# Altium schematic sheet FPGA_52_CAN_Receiver.SchDoc
size A3; Address1: L3, 12a Rodborough Rd; Address2: Frenchs Forest; Address3: NSW; Address4: Australia 2086; Organization: Altium Limited
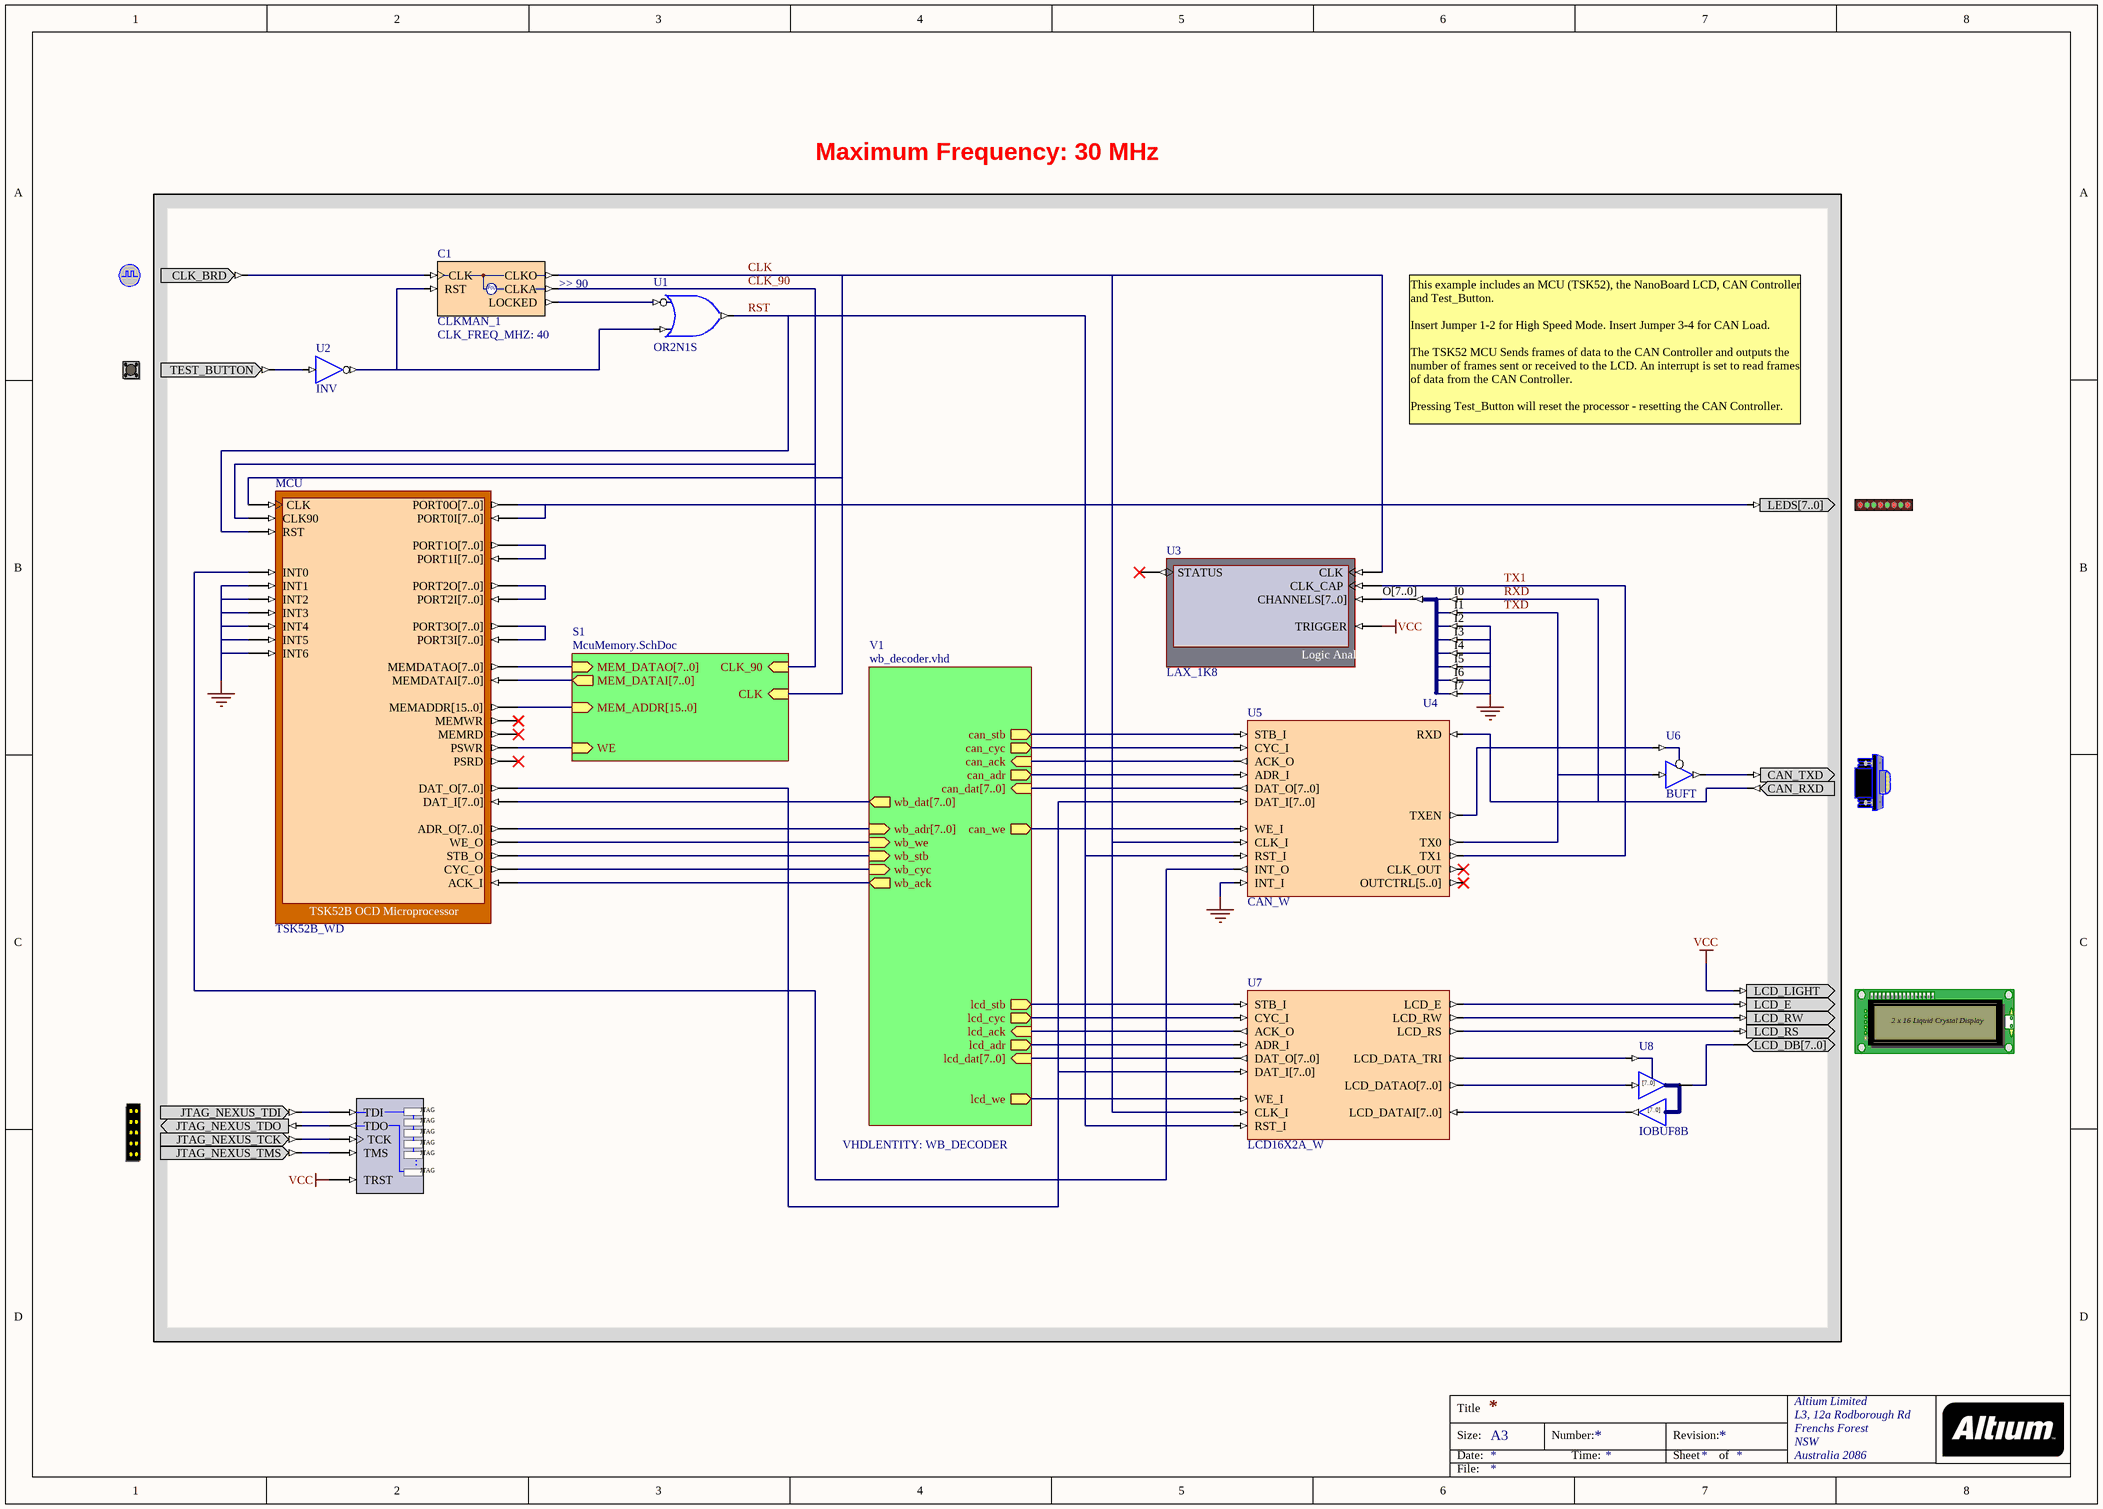
[diagram p0: FPGA_52_CAN_Receiver.SchDoc]

## Parts
(Parts that share a designator on the sheet are numbered #1, #2 ... from top to bottom, then left to right.)
?#1  CLOCK_BOARD  (value not drawn)
?#2  TEST_BUTTON  (value not drawn)
?#3  LED  (value not drawn)
?#4  CANCNTR  (value not drawn)
?#5  LCD  (value not drawn)
?#6  NEXUS_JTAG_CONNECTOR  (value not drawn)
C1  CLKMAN_1  CLK_FREQ_MHZ: 40  ClkA_Operation: >> 90
MCU  TSK52B_WD
NEXUS_JTAG_PORT  NEXUS_JTAG_PORT  (value not drawn)
U1  OR2N1S
U2  INV
U3  LAX_1K8
U4  J8S_8B  (value not drawn)
U5  CAN_W
U6  BUFT
U7  LCD16X2A_W
U8  IOBUF8B

## Sub-sheets
S1 = McuMemory.SchDoc: MEM_ADDR[15..0] (in), MEM_DATAI[7..0] (out), MEM_DATAO[7..0] (in), WE (in), CLK (in), CLK_90 (in)
V1 = wb_decoder.vhd: can_ack (in), can_adr (out), can_cyc (out), can_dat[7..0] (in), can_stb (out), can_we (out), lcd_ack (in), lcd_adr (out), lcd_cyc (out), lcd_dat[7..0] (in), lcd_stb (out), lcd_we (out), wb_ack (out), wb_adr[7..0] (in), wb_cyc (in), wb_dat[7..0] (out), wb_stb (in), wb_we (in)  | VHDLENTITY: WB_DECODER

## Nets
GND: MCU.INT1 MCU.INT2 MCU.INT3 MCU.INT4 MCU.INT5 MCU.INT6 U4.I2 U4.I3 U4.I4 U4.I5 U4.I6 U4.I7 U5.INT_I
VCC: ?#5.LCD_LIGHT NEXUS_JTAG_PORT.TRST U3.TRIGGER
CLK: C1.CLKO MCU.CLK U3.CLK U5.CLK_I U7.CLK_I ; sheet S1/CLK
CLK_90: C1.CLKA MCU.CLK90 ; sheet S1/CLK_90
RST: MCU.RST U1.O U5.RST_I U7.RST_I
RXD: ?#4.CAN_RXD U4.I0 U5.RXD
TX1: U3.CLK_CAP U5.TX1
TXD: U4.I1 U5.TX0 U6.I
Net?#1_CLK_BRD: ?#1.CLK_BRD C1.CLK
Net?#2_TEST_BUTTON: ?#2.TEST_BUTTON U2.I
Net?#3_LEDS[7..0]: ?#3.LEDS[7..0] MCU.PORT0I[7..0] MCU.PORT0O[7..0]
Net?#4_CAN_TXD: ?#4.CAN_TXD U6.O(Y)
Net?#5_LCD_DB[7..0]: ?#5.LCD_DB[7..0] U8.IO[7..0]
Net?#5_LCD_E: ?#5.LCD_E U7.LCD_E
Net?#5_LCD_RS: ?#5.LCD_RS U7.LCD_RS
Net?#5_LCD_RW: ?#5.LCD_RW U7.LCD_RW
Net?#6_JTAG_NEXUS_TCK: ?#6.JTAG_NEXUS_TCK NEXUS_JTAG_PORT.TCK
Net?#6_JTAG_NEXUS_TDI: ?#6.JTAG_NEXUS_TDI NEXUS_JTAG_PORT.TDI
Net?#6_JTAG_NEXUS_TDO: ?#6.JTAG_NEXUS_TDO NEXUS_JTAG_PORT.TDO
Net?#6_JTAG_NEXUS_TMS: ?#6.JTAG_NEXUS_TMS NEXUS_JTAG_PORT.TMS
NetC1_LOCKED: C1.LOCKED U1.I0
NetC1_RST: C1.RST U1.I1 U2.O
NetMCU_ACK_I: MCU.ACK_I ; sheet V1/wb_ack
NetMCU_ADR_O[7..0]: MCU.ADR_O[7..0] ; sheet V1/wb_adr[7..0]
NetMCU_CYC_O: MCU.CYC_O ; sheet V1/wb_cyc
NetMCU_DAT_I[7..0]: MCU.DAT_I[7..0] ; sheet V1/wb_dat[7..0]
NetMCU_DAT_O[7..0]: MCU.DAT_O[7..0] U5.DAT_I[7..0] U7.DAT_I[7..0]
NetMCU_INT0: MCU.INT0 U5.INT_O
NetMCU_MEMADDR[15..0]: MCU.MEMADDR[15..0] ; sheet S1/MEM_ADDR[15..0]
NetMCU_MEMDATAI[7..0]: MCU.MEMDATAI[7..0] ; sheet S1/MEM_DATAI[7..0]
NetMCU_MEMDATAO[7..0]: MCU.MEMDATAO[7..0] ; sheet S1/MEM_DATAO[7..0]
NetMCU_PORT1I[7..0]: MCU.PORT1I[7..0] MCU.PORT1O[7..0]
NetMCU_PORT2I[7..0]: MCU.PORT2I[7..0] MCU.PORT2O[7..0]
NetMCU_PORT3I[7..0]: MCU.PORT3I[7..0] MCU.PORT3O[7..0]
NetMCU_PSWR: MCU.PSWR ; sheet S1/WE
NetMCU_STB_O: MCU.STB_O ; sheet V1/wb_stb
NetMCU_WE_O: MCU.WE_O ; sheet V1/wb_we
NetU3_CHANNELS[7..0]: U3.CHANNELS[7..0] U4.O[7..0]
NetU5_ACK_O: U5.ACK_O ; sheet V1/can_ack
NetU5_ADR_I: U5.ADR_I ; sheet V1/can_adr
NetU5_CYC_I: U5.CYC_I ; sheet V1/can_cyc
NetU5_DAT_O[7..0]: U5.DAT_O[7..0] ; sheet V1/can_dat[7..0]
NetU5_STB_I: U5.STB_I ; sheet V1/can_stb
NetU5_TXEN: U5.TXEN U6.T
NetU5_WE_I: U5.WE_I ; sheet V1/can_we
NetU7_ACK_O: U7.ACK_O ; sheet V1/lcd_ack
NetU7_ADR_I: U7.ADR_I ; sheet V1/lcd_adr
NetU7_CYC_I: U7.CYC_I ; sheet V1/lcd_cyc
NetU7_DAT_O[7..0]: U7.DAT_O[7..0] ; sheet V1/lcd_dat[7..0]
NetU7_LCD_DATA_TRI: U7.LCD_DATA_TRI U8.T
NetU7_LCD_DATAI[7..0]: U7.LCD_DATAI[7..0] U8.O[7..0]
NetU7_LCD_DATAO[7..0]: U7.LCD_DATAO[7..0] U8.I[7..0]
NetU7_STB_I: U7.STB_I ; sheet V1/lcd_stb
NetU7_WE_I: U7.WE_I ; sheet V1/lcd_we

Not connected (* = marked no-connect by the designer): MCU MEMRD* MEMWR* PSRD*; U3 STATUS*; U5 CLK_OUT* OUTCTRL[5..0]*

## Notes on the sheet
- Maximum Frequency: 30 MHz
- This example includes an MCU (TSK52), the NanoBoard LCD, CAN Controller and Test_Button.
  Insert Jumper 1-2 for High Speed Mode. Insert Jumper 3-4 for CAN Load.
  The TSK52 MCU Sends frames of data to the CAN Controller and outputs the number of frames sent or received to the LCD. An interrupt is set to read frames of data from the CAN Controller.
  Pressing Test_Button will reset the processor - resetting the CAN Controller.
- Title
- Size:
- Date:
- A3
- Number:
- Time:
- Revision:
- Sheet
- of
- File:
- (in symbol CLKMAN_1) F(x)
- (in symbol IOBUF8B) [7..0]
- (in symbol LAX_1K8) Logic Analyser
- (in symbol LCD) 2 x 16 Liquid Crystal Display
- (in symbol NEXUS_JTAG_PORT) JTAG; .

## Library data of the parts
?#1 = CLOCK_BOARD: Global System Clock Supply; PortComponent: True; Published: 19-Nov-2003; Publisher: Altium Limited
?#2 = TEST_BUTTON: Test Button; PortComponent: True; Published: 19-Nov-2003; Publisher: Altium Limited
?#3 = LED: 8-Way LEDS; PortComponent: True; Published: 19-Nov-2003; Publisher: Altium Limited
?#4 = CANCNTR: CAN Bus Connector; PortComponent: True; Published: 19-Nov-2003; Publisher: Altium Limited
?#5 = LCD: Liquid Crystal Display; PortComponent: True; Published: 19-Nov-2003; Publisher: Altium Limited
?#6 = NEXUS_JTAG_CONNECTOR: JTAG Port; PortComponent: True; Published: 19-Nov-2003; Publisher: Altium Limited
C1 = CLKMAN_1: Single Operational Output Clock Manager; Clk_Count: 1; Published: 5-Jul-2004; Publisher: Altium Limited; Core Revision: 1.00.00; Nexus_Core: ClockManager; HelpURL: CR0118 FPGA Generic Library Guide.pdf#page=148; Functional Class: Clock Manager; Port Size: 1
MCU = TSK52B_WD: TSK52B OCD Microprocessor; NEXUS_CORE: Processor_OCDS; NEXUS_JTAG_DEVICE: True; NEXUS_JTAG_ORDER: 0; ChildModel1: TSK52B_WD_DRAM8X256; ChildCore1: M1; Published: 5/07/2004; Publisher: Altium Hobart Technology Centre; Core Revision: 1.00.00
NEXUS_JTAG_PORT = NEXUS_JTAG_PORT: Soft Nexus-Chain Connector; NEXUS_JTAG_CONNECTOR: True; Published: 18-Dec-2003; Publisher: Altium Limited
U1 = OR2N1S: 2-Input OR Gate with Active Low A Input, Single Pin Version; Xilinx Equivalent: OR2B1; ArchiveName: GENERIC; VHDLIB_SIM: GENERIC_LIB; Published: 29-Jan-2004; Publisher: Altium Limited; Core Revision: 1.00.00
U2 = INV: Inverter; ArchiveName: GENERIC; VHDLIB_SIM: GENERIC_LIB; Published: 29-Jan-2004; Publisher: Altium Limited; Xilinx Equivalent: INV; Core Revision: 1.00.00
U3 = LAX_1K8: Logic Analyser 1K8; NEXUS_CORE: Instrument; NEXUS_JTAG_DEVICE: True; NEXUS_JTAG_ORDER: 0; ChildModel1: RAM1KX8_LA8_1K; Published: 18/12/2003; Publisher: Altium Hobart Technology Centre; Core Revision: 1.00.00
U4 = J8S_8B: 8 Single pin inputs to single 8-Bit output bus; Functional Class: Bus Joiner; Port Size: 8; ArchiveName: GENERIC; VHDLIB_SIM: GENERIC_LIB; Published: 29-Jan-2004; Publisher: Altium Limited; Core Revision: 1.00.00; HelpURL: CR0118 FPGA Generic Library Guide.pdf#page=305
U5 = CAN_W: CAN Controller Wishbone; ChildModel1: CAN10000_DRAM8X64; Published: 9-Dec-2004; Publisher: Altium Limited; ComponentLink1Description: Core &Resource Usage; ComponentLink1URL: CR0139 FPGA Peripheral Resource Usage.pdf#page=3; HelpURL: CR0104 CAN Controller.pdf#page=3; LastRevisionNo: 1.00.00
U6 = BUFT: 1-Bit 3-state Buffer with Active Low Enable; ArchiveName: GENERIC; Published: 18-Nov-2003; Publisher: Altium Limited; Xilinx Equivalent: BUFT; Core Revision: 1.00.00
U7 = LCD16X2A_W: LCD Controller Wishbone; Published: 9-Dec-2004; Publisher: Altium Limited; ComponentLink1Description: Core &Resource Usage; ComponentLink1URL: CR0139 FPGA Peripheral Resource Usage.pdf#page=17; HelpURL: CR0107 LCD16X2 LCD Controller.pdf#page=2; LastRevisionNo: 1.00.00
U8 = IOBUF8B: 8-Bit Input/Output Buffer, Bus Version; ArchiveName: GENERIC; Published: 18-Dec-2003; Publisher: Altium Limited; Core Revision: 1.00.00